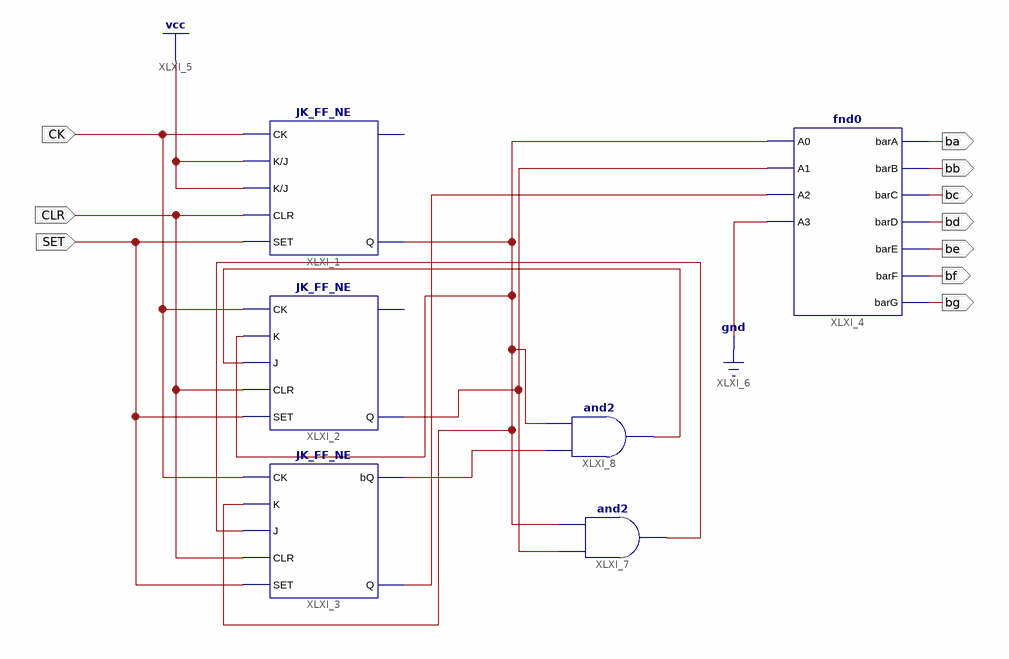
[diagram p0: schematic sheet 1]
// Xilinx ISE schematic Mod6.sch (spartan6) as structural Verilog: 6 symbols, 10 ports
module Mod6 (
  input  CK,
  input  CLR,
  input  SET,
  output ba,
  output bb,
  output bc,
  output bd,
  output be,
  output bf,
  output bg
);

  wire XLXN_18, XLXN_23, XLXN_26, XLXN_34, XLXN_36, XLXN_37;

  JK_FF_NE XLXI_1 (.CK(CK), .K(1'b1), .J(1'b1), .CLR(CLR), .SET(SET), .Q(XLXN_36));  // open: bQ
  JK_FF_NE XLXI_2 (.CK(CK), .K(XLXN_36), .J(XLXN_26), .CLR(CLR), .SET(SET), .Q(XLXN_37));  // open: bQ
  JK_FF_NE XLXI_3 (.CK(CK), .K(XLXN_36), .J(XLXN_23), .CLR(CLR), .SET(SET), .bQ(XLXN_18), .Q(XLXN_34));
  fnd0 XLXI_4 (
    .A0(XLXN_36), .A1(XLXN_37), .A2(XLXN_34), .A3(1'b0), .barA(ba), .barB(bb), .barC(bc), .barD(bd),
    .barE(be), .barF(bf), .barG(bg));
  and XLXI_7 (XLXN_23, XLXN_37, XLXN_36);
  and XLXI_8 (XLXN_26, XLXN_18, XLXN_36);
endmodule
